# EAGLE schematic Enclosure 100x68 PB (EAGLE 9.6.2)
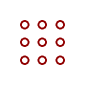
[diagram p0: schematic, sheet 1]

## Parts
U$1  PROTO-34X22  [PROTO-34X22]

## Library data of the parts
U$1 = digitalconcepts:PROTO-34X22: 34 x 22 Prototyping board to fit an 100 x 68 enclosure